# EAGLE schematic PowerManagementSchem (EAGLE 9.4.2)

## Sheet 1 of 5: DCDC Converters <And related filtering parts. Input connection but not outputs>
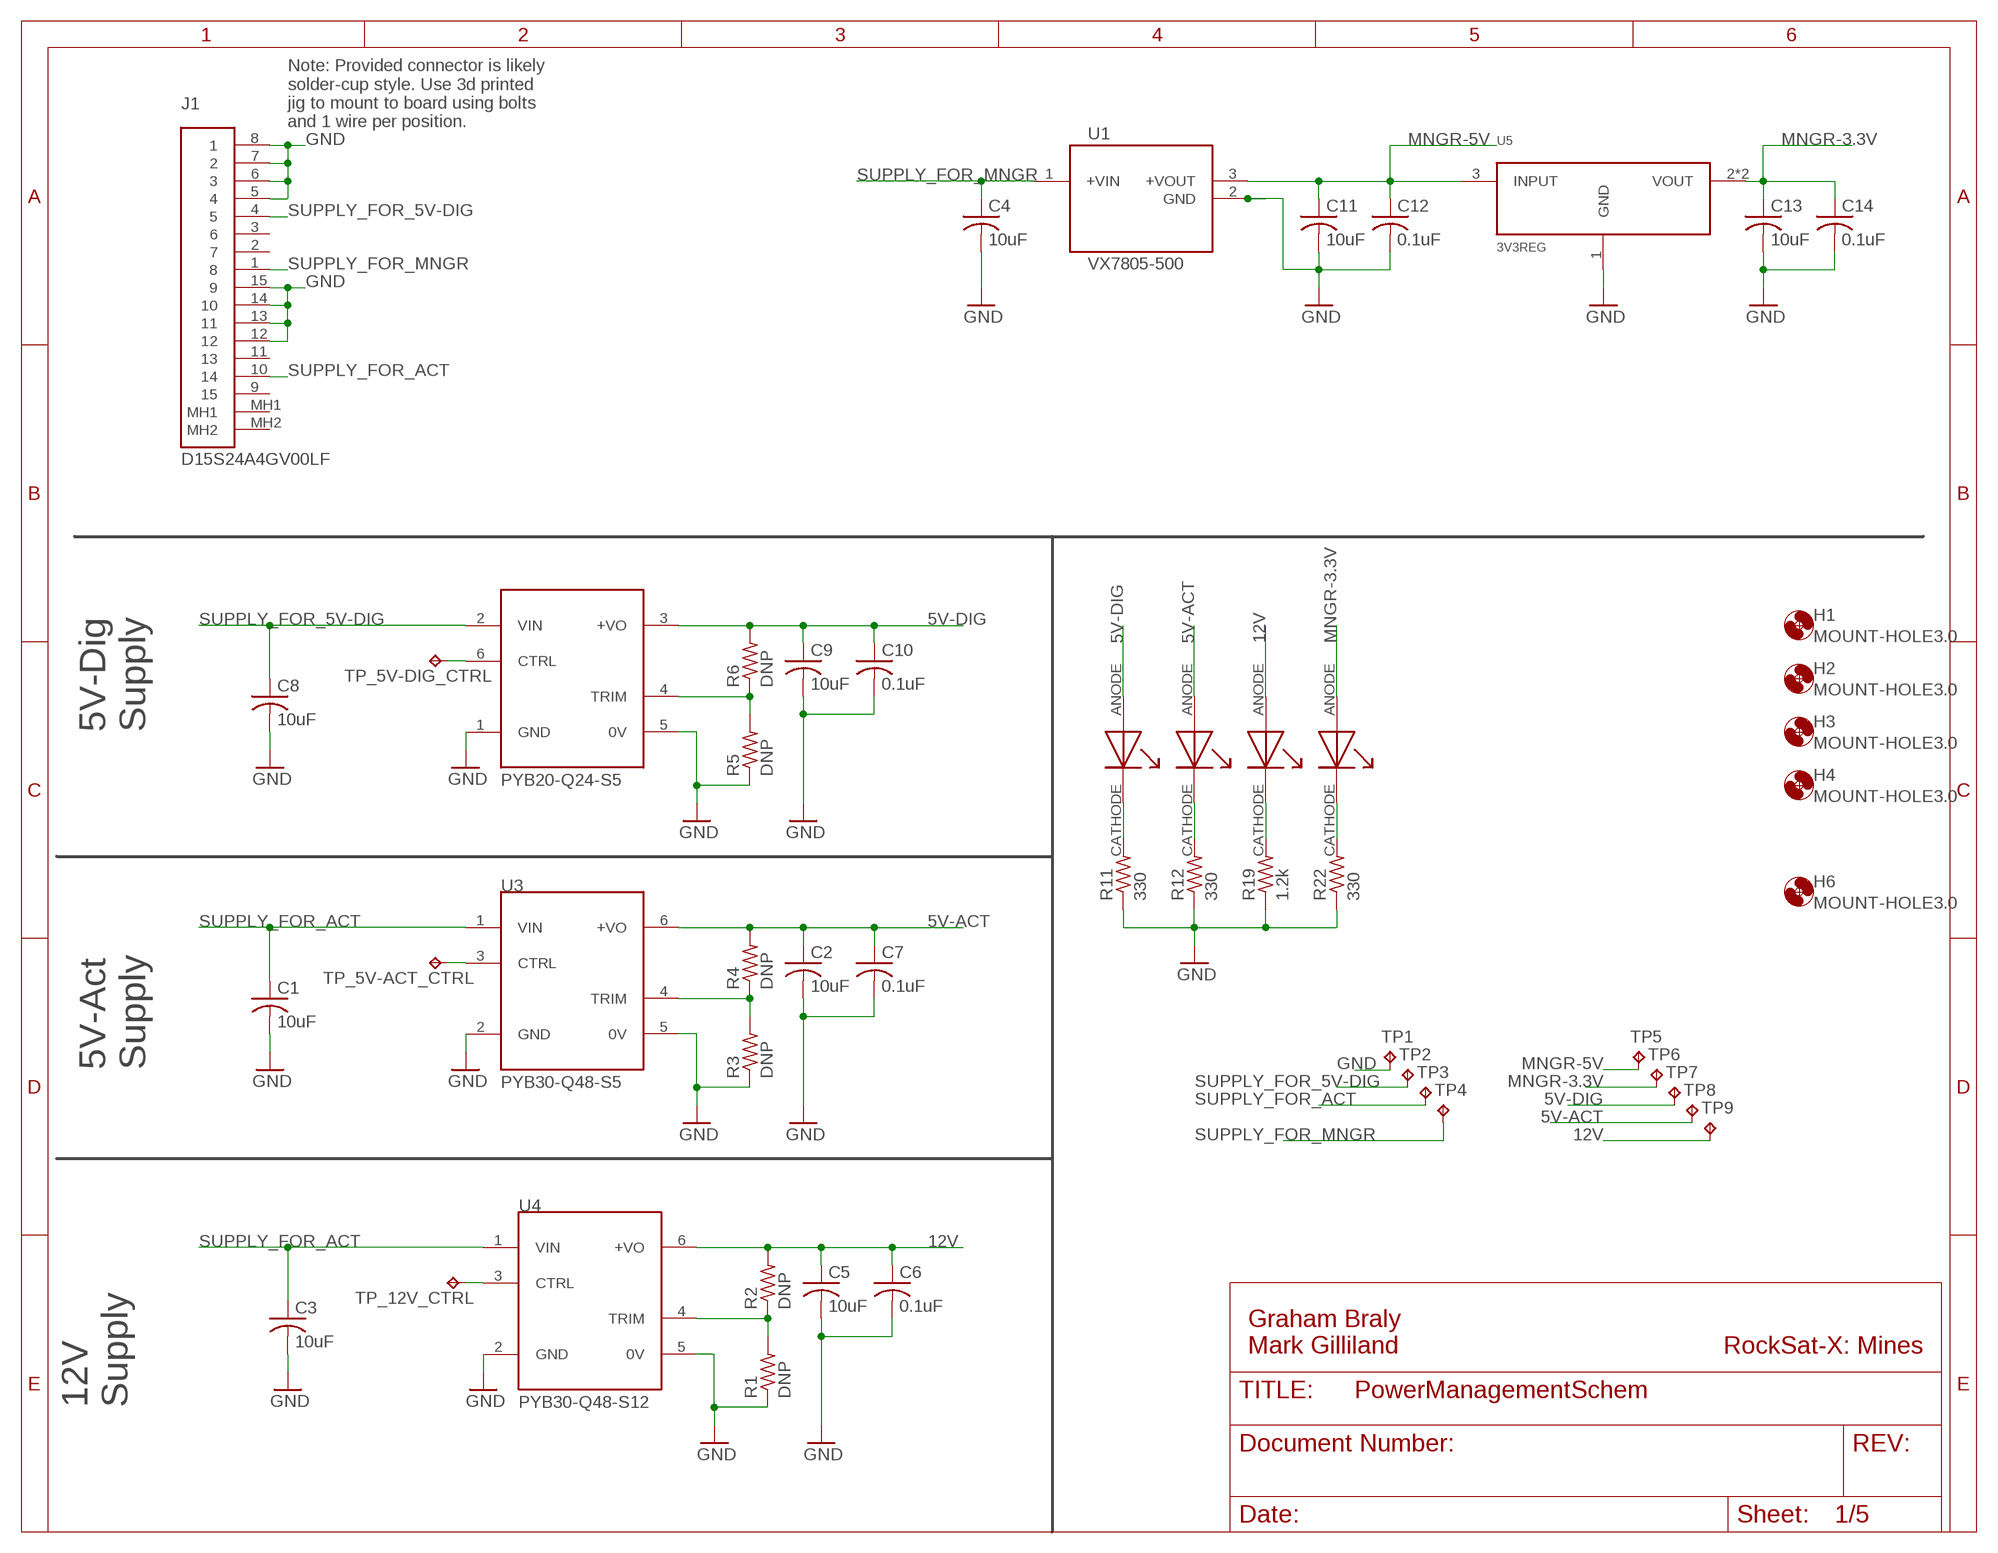
[diagram p0: schematic, sheet 1]

### Parts
C1  10uF  C-USC1206  [C1206]
C2  10uF  C-USC0805  [C0805]
C3  10uF  C-USC1206  [C1206]
C4  10uF  C-USC1206  [C1206]
C5  10uF  C-USC0805  [C0805]
C6  0.1uF  C-USC0805  [C0805]
C7  0.1uF  C-USC0805  [C0805]
C8  10uF  C-USC1206  [C1206]
C9  10uF  C-USC0805  [C0805]
C10  0.1uF  C-USC0805  [C0805]
C11  10uF  C-USC0805  [C0805]
C12  0.1uF  C-USC0805  [C0805]
C13  10uF  C-USC0805  [C0805]
C14  0.1uF  C-USC0805  [C0805]
H1  MOUNT-HOLE3.0  [3,0]
H2  MOUNT-HOLE3.0  [3,0]
H3  MOUNT-HOLE3.0  [3,0]
H4  MOUNT-HOLE3.0  [3,0]
H6  MOUNT-HOLE3.0  [3,0]
J1  D15S24A4GV00LF  [D15S24A4GV00LF]
R1  DNP  R-US_R0805  [R0805]
R2  DNP  R-US_R0805  [R0805]
R3  DNP  R-US_R0805  [R0805]
R4  DNP  R-US_R0805  [R0805]
R5  DNP  R-US_R0805  [R0805]
R6  DNP  R-US_R0805  [R0805]
R11  330  R-US_R0805  [R0805]
R12  330  R-US_R0805  [R0805]
R19  1.2k  R-US_R0805  [R0805]
R22  330  R-US_R0805  [R0805]
TP1  TPPAD1-13  [P1-13]
TP2  TPPAD1-13  [P1-13]
TP3  TPPAD1-13  [P1-13]
TP4  TPPAD1-13  [P1-13]
TP5  TPPAD1-13  [P1-13]
TP6  TPPAD1-13  [P1-13]
TP7  TPPAD1-13  [P1-13]
TP8  TPPAD1-13  [P1-13]
TP9  TPPAD1-13  [P1-13]
TP_5V-ACT_CTRL  TPPAD1-13  [P1-13]
TP_5V-DIG_CTRL  TPPAD1-13  [P1-13]
TP_12V_CTRL  TPPAD1-13  [P1-13]
U1  VX7805-500  [VX78012-500_VX7805-500]
U2  PYB20-Q24-S5  [CONV_PYB20-Q24-S5]
U3  PYB30-Q48-S5  [CONV_PYB30-Q48-S5]
U4  PYB30-Q48-S12  [CONV_PYB30-Q48-S12]
U5  3V3REG  [SOT223]
U$9  FLAT_LED  [FLAT_LED]
U$10  FLAT_LED  [FLAT_LED]
U$17  FLAT_LED  [FLAT_LED]
U$20  FLAT_LED  [FLAT_LED]

### Nets
5V-ACT: C2.1 C7.1 R4.2 TP8.TP U3.6(+VO) U$10.ANODE ; also sheet 3,4
5V-ACT-CTRL: TP_5V-ACT_CTRL.TP U3.3(CTRL)
5V-ACT-TRIM: R3.2 R4.1 U3.4(TRIM)
5V-DIG: C9.1 C10.1 R6.2 TP7.TP U2.3(+VO) U$9.ANODE ; also sheet 3,4
5V-DIG-CTRL: TP_5V-DIG_CTRL.TP U2.6(CTRL)
5V-DIG-TRIM: R5.2 R6.1 U2.4(TRIM)
12V: C5.1 C6.1 R2.2 TP9.TP U4.6(+VO) U$17.ANODE ; also sheet 5
12V-CTRL: TP_12V_CTRL.TP U4.3(CTRL)
12V-TRIM: R1.2 R2.1 U4.4(TRIM)
GND: C1.2 C2.2 C3.2 C4.2 C5.2 C6.2 C7.2 C8.2 C9.2 C10.2 C11.2 C12.2 C13.2 C14.2 J1.5 J1.6 J1.7 J1.8 J1.12 J1.13 J1.14 J1.15 R1.1 R11.1 R12.1 R19.1 R22.1 TP1.TP U1.2(GND) U2.1(GND) U3.2(GND) U4.2(GND) U4.5(0V) U5.1(GND) ; also sheet 2,3,4,5
MNGR-3.3V: C13.1 C14.1 TP6.TP U5.2(VOUT) U5.4(VOUT) U$20.ANODE ; also sheet 2,3,4
MNGR-5V: C11.1 C12.1 TP5.TP U1.3(+VOUT) U5.3(INPUT) ; also sheet 2
N$5: R3.1 U3.5(0V) ; supply symbol labelled GND
N$8: R5.1 U2.5(0V) ; supply symbol labelled GND
N$17: R11.2 U$9.CATHODE
N$18: R12.2 U$10.CATHODE
N$19: R19.2 U$17.CATHODE
N$20: R22.2 U$20.CATHODE
SUPPLY_FOR_5V-DIG [hv-lines]: C8.1 J1.4 TP2.TP U2.2(VIN)
SUPPLY_FOR_ACT [hv-lines]: C1.1 C3.1 J1.10 TP3.TP U3.1(VIN) U4.1(VIN)
SUPPLY_FOR_MNGR: C4.1 J1.1 TP4.TP U1.1(+VIN)
Unconnected: J1.2 J1.3 J1.9 J1.11 J1.MH1 J1.MH2

### Notes on the sheet
- Note: Provided connector is likely 
  solder-cup style. Use 3d printed
  jig to mount to board using bolts
  and 1 wire per position.
- 5V-Dig
  Supply
- 5V-Act
  Supply
- Graham Braly
  Mark Gilliland
- RockSat-X: Mines
- 12V 
  Supply

## Sheet 2 of 5: Teensy Connections <Connections for the Teensy and possible datalogging capability. Do not include op-amps here.>
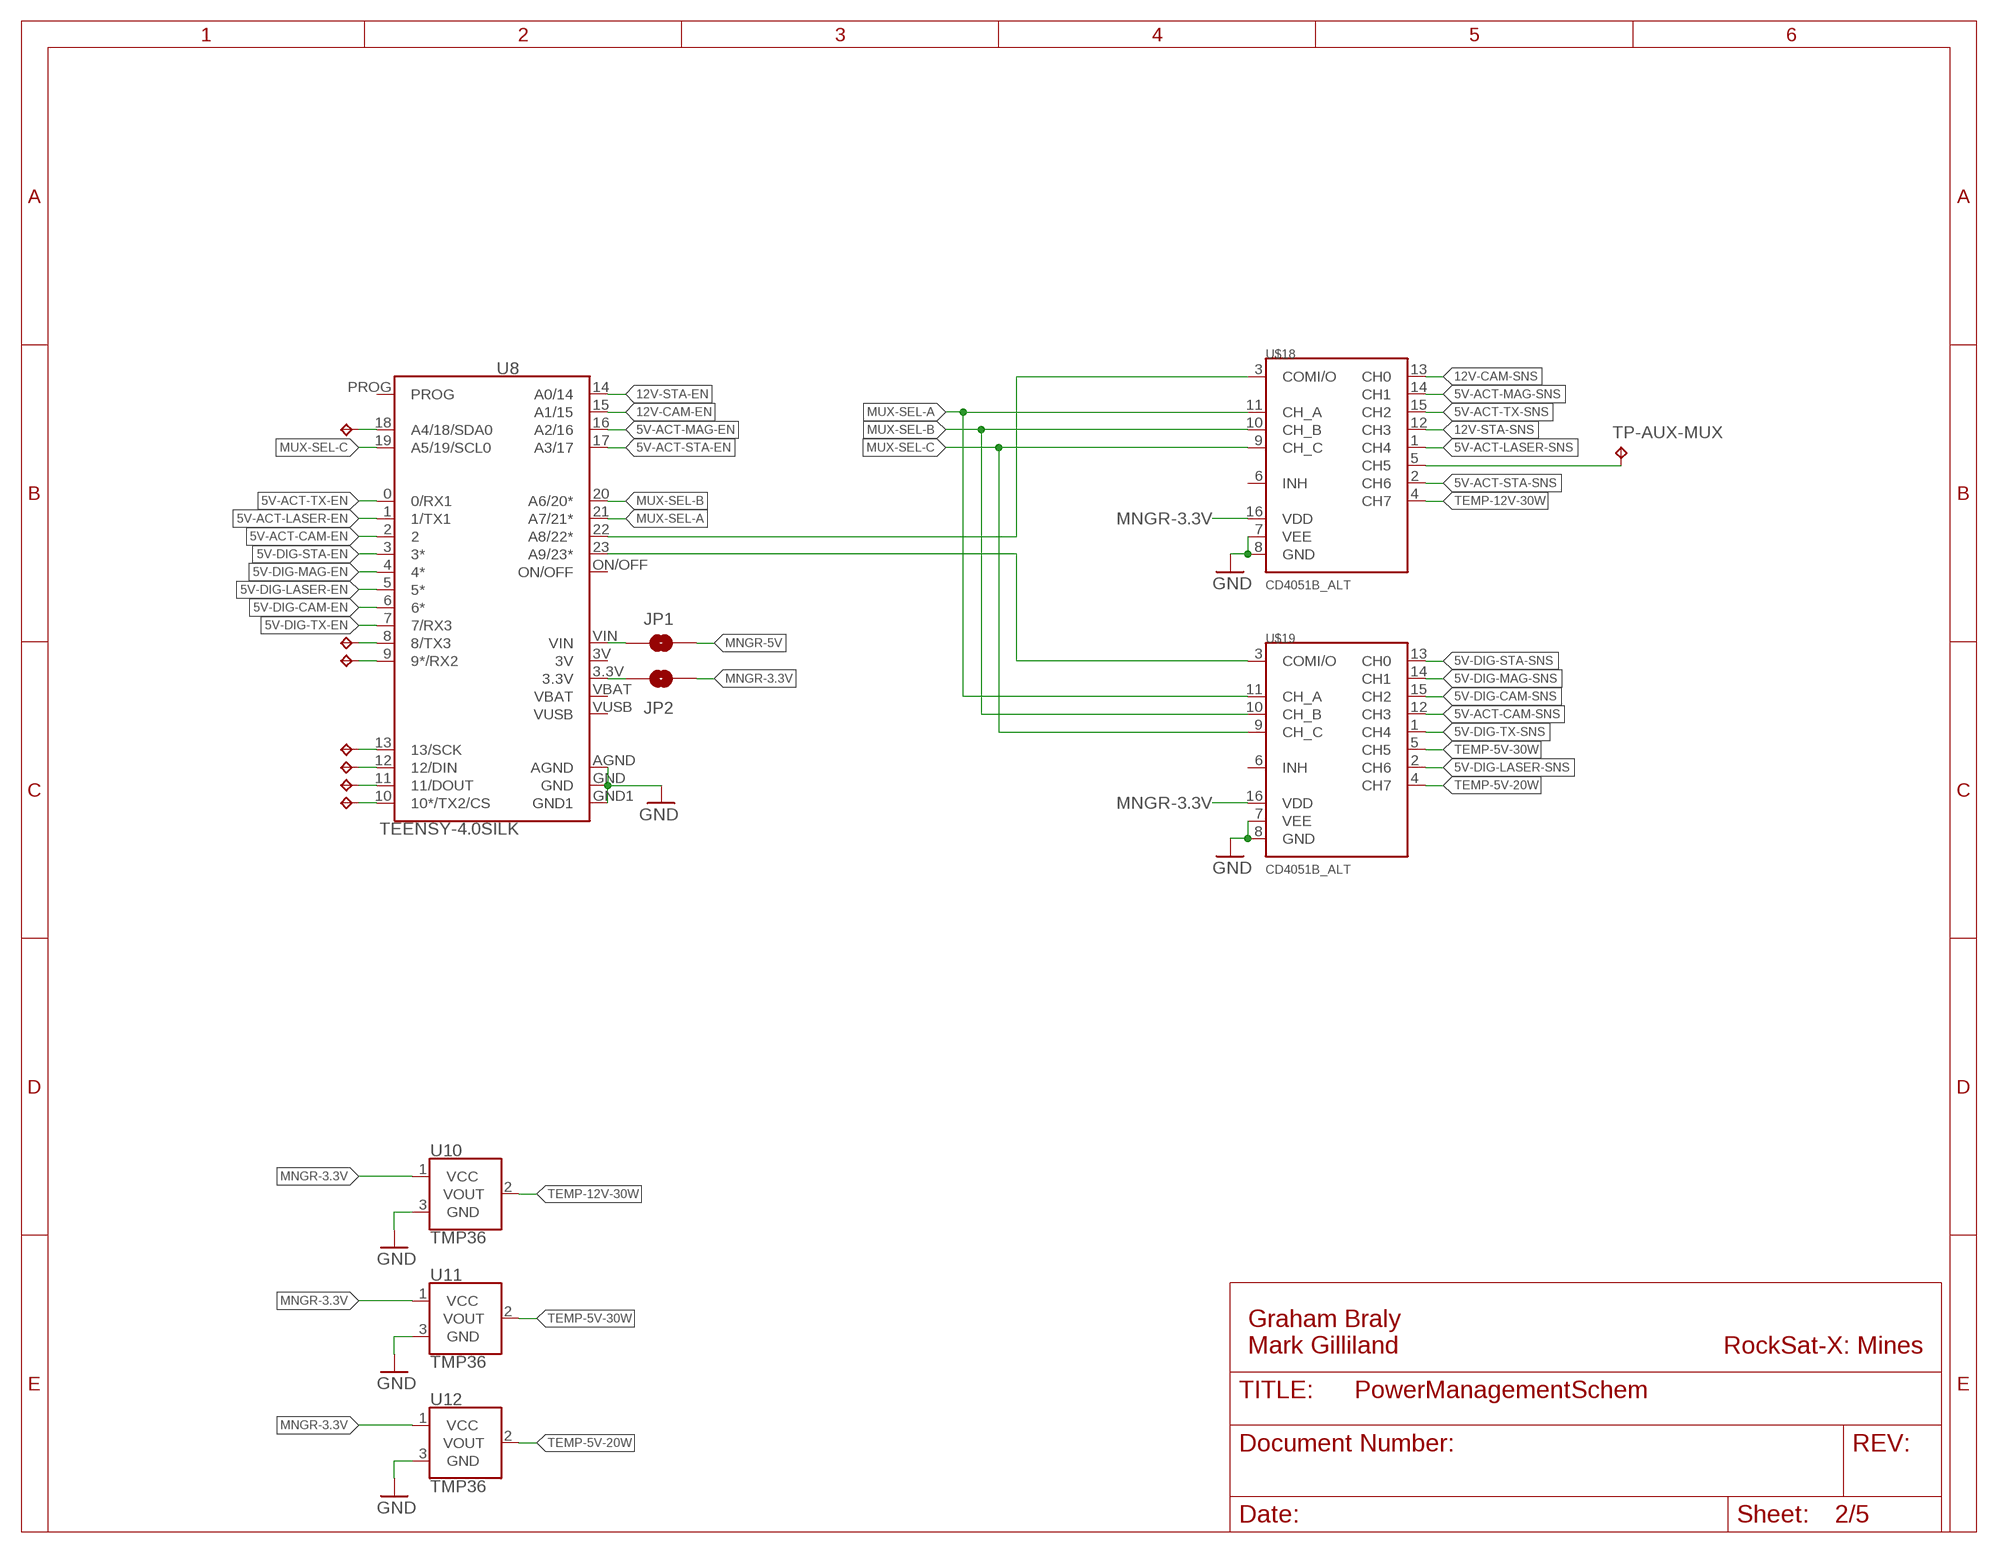
[diagram p1: schematic, sheet 2]

### Parts
JP1  JUMPER-SMT_2_NO_NO-SILK  [SMT-JUMPER_2_NO_NO-SILK]
JP2  JUMPER-SMT_2_NO_NO-SILK  [SMT-JUMPER_2_NO_NO-SILK]
TP10  TPPAD1-13  [P1-13]
TP11  TPPAD1-13  [P1-13]
TP12  TPPAD1-13  [P1-13]
TP13  TPPAD1-13  [P1-13]
TP14  TPPAD1-13  [P1-13]
TP15  TPPAD1-13  [P1-13]
TP16  TPPAD1-13  [P1-13]
TP-AUX-MUX  TPPAD1-13  [P1-13]
U8  TEENSY-4.0SILK  [TEENSY-4.0]
U10  TMP36  TMP36GT9  [TO-92]
U11  TMP36  TMP36GT9  [TO-92]
U12  TMP36  TMP36GT9  [TO-92]
U$18  CD4051B_ALT  [SOIC16N]
U$19  CD4051B_ALT  [SOIC16N]

### Nets
5V-ACT-CAM-EN: U8.2 ; also sheet 4
5V-ACT-CAM-SNS: U$19.12(CH3) ; also sheet 4
5V-ACT-LASER-EN: U8.1(1/TX1) ; also sheet 3
5V-ACT-LASER-SNS: U$18.1(CH4) ; also sheet 3
5V-ACT-MAG-EN: U8.16(A2/16) ; also sheet 4
5V-ACT-MAG-SNS: U$18.14(CH1) ; also sheet 4
5V-ACT-STA-EN: U8.17(A3/17) ; also sheet 4
5V-ACT-STA-SNS: U$18.2(CH6) ; also sheet 4
5V-ACT-TX-EN: U8.0(0/RX1) ; also sheet 3
5V-ACT-TX-SNS: U$18.15(CH2) ; also sheet 3
5V-DIG-CAM-EN: U8.6(6*) ; also sheet 4
5V-DIG-CAM-SNS: U$19.15(CH2) ; also sheet 4
5V-DIG-LASER-EN: U8.5(5*) ; also sheet 3
5V-DIG-LASER-SNS: U$19.2(CH6) ; also sheet 3
5V-DIG-MAG-EN: U8.4(4*) ; also sheet 4
5V-DIG-MAG-SNS: U$19.14(CH1) ; also sheet 4
5V-DIG-STA-EN: U8.3(3*) ; also sheet 4
5V-DIG-STA-SNS: U$19.13(CH0) ; also sheet 4
5V-DIG-TX-EN: U8.7(7/RX3) ; also sheet 3
5V-DIG-TX-SNS: U$19.1(CH4) ; also sheet 3
12V-CAM-EN: U8.15(A1/15) ; also sheet 5
12V-CAM-SNS: U$18.13(CH0) ; also sheet 5
12V-STA-EN: U8.14(A0/14) ; also sheet 5
12V-STA-SNS: U$18.12(CH3) ; also sheet 5
CURRENT-SNS-A: U8.22(A8/22*) U$18.3(COMI/O)
CURRENT-SNS-B: U8.23(A9/23*) U$19.3(COMI/O)
GND: U8.AGND U8.GND U8.GND1 U10.3(GND) U11.3(GND) U12.3(GND) U$18.7(VEE) U$18.8(GND) U$19.7(VEE) U$19.8(GND) ; also sheet 1,3,4,5
MNGR-3.3V: JP2.2 U10.1(VCC) U11.1(VCC) U12.1(VCC) U$18.16(VDD) U$19.16(VDD) ; also sheet 1,3,4
MNGR-5V: JP1.2 ; also sheet 1
MUX-SEL-A: U8.21(A7/21*) U$18.11(CH_A) U$19.11(CH_A)
MUX-SEL-B: U8.20(A6/20*) U$18.10(CH_B) U$19.10(CH_B)
MUX-SEL-C: U8.19(A5/19/SCL0) U$18.9(CH_C) U$19.9(CH_C)
N$1: TP-AUX-MUX.TP U$18.5(CH5)
N$2: TP10.TP U8.8(8/TX3)
N$3: TP11.TP U8.9(9*/RX2)
N$4: TP12.TP U8.13(13/SCK)
N$6: TP13.TP U8.12(12/DIN)
N$7: TP14.TP U8.11(11/DOUT)
N$33: TP15.TP U8.10(10*/TX2/CS)
N$35: TP16.TP U8.18(A4/18/SDA0)
N$37: JP1.1 U8.VIN
N$38: JP2.1 U8.3.3V
TEMP-5V-20W: U12.2(VOUT) U$19.4(CH7)
TEMP-5V-30W: U11.2(VOUT) U$19.5(CH5)
TEMP-12V-30W: U10.2(VOUT) U$18.4(CH7)
Unconnected: U8.ON/OFF U8.PROG U$18.6(INH) U$19.6(INH)

### Notes on the sheet
- Graham Braly
  Mark Gilliland
- RockSat-X: Mines

## Sheet 3 of 5: TX & Laser Control and Sense <Current Sense circuits, outputs, and multiplexing>
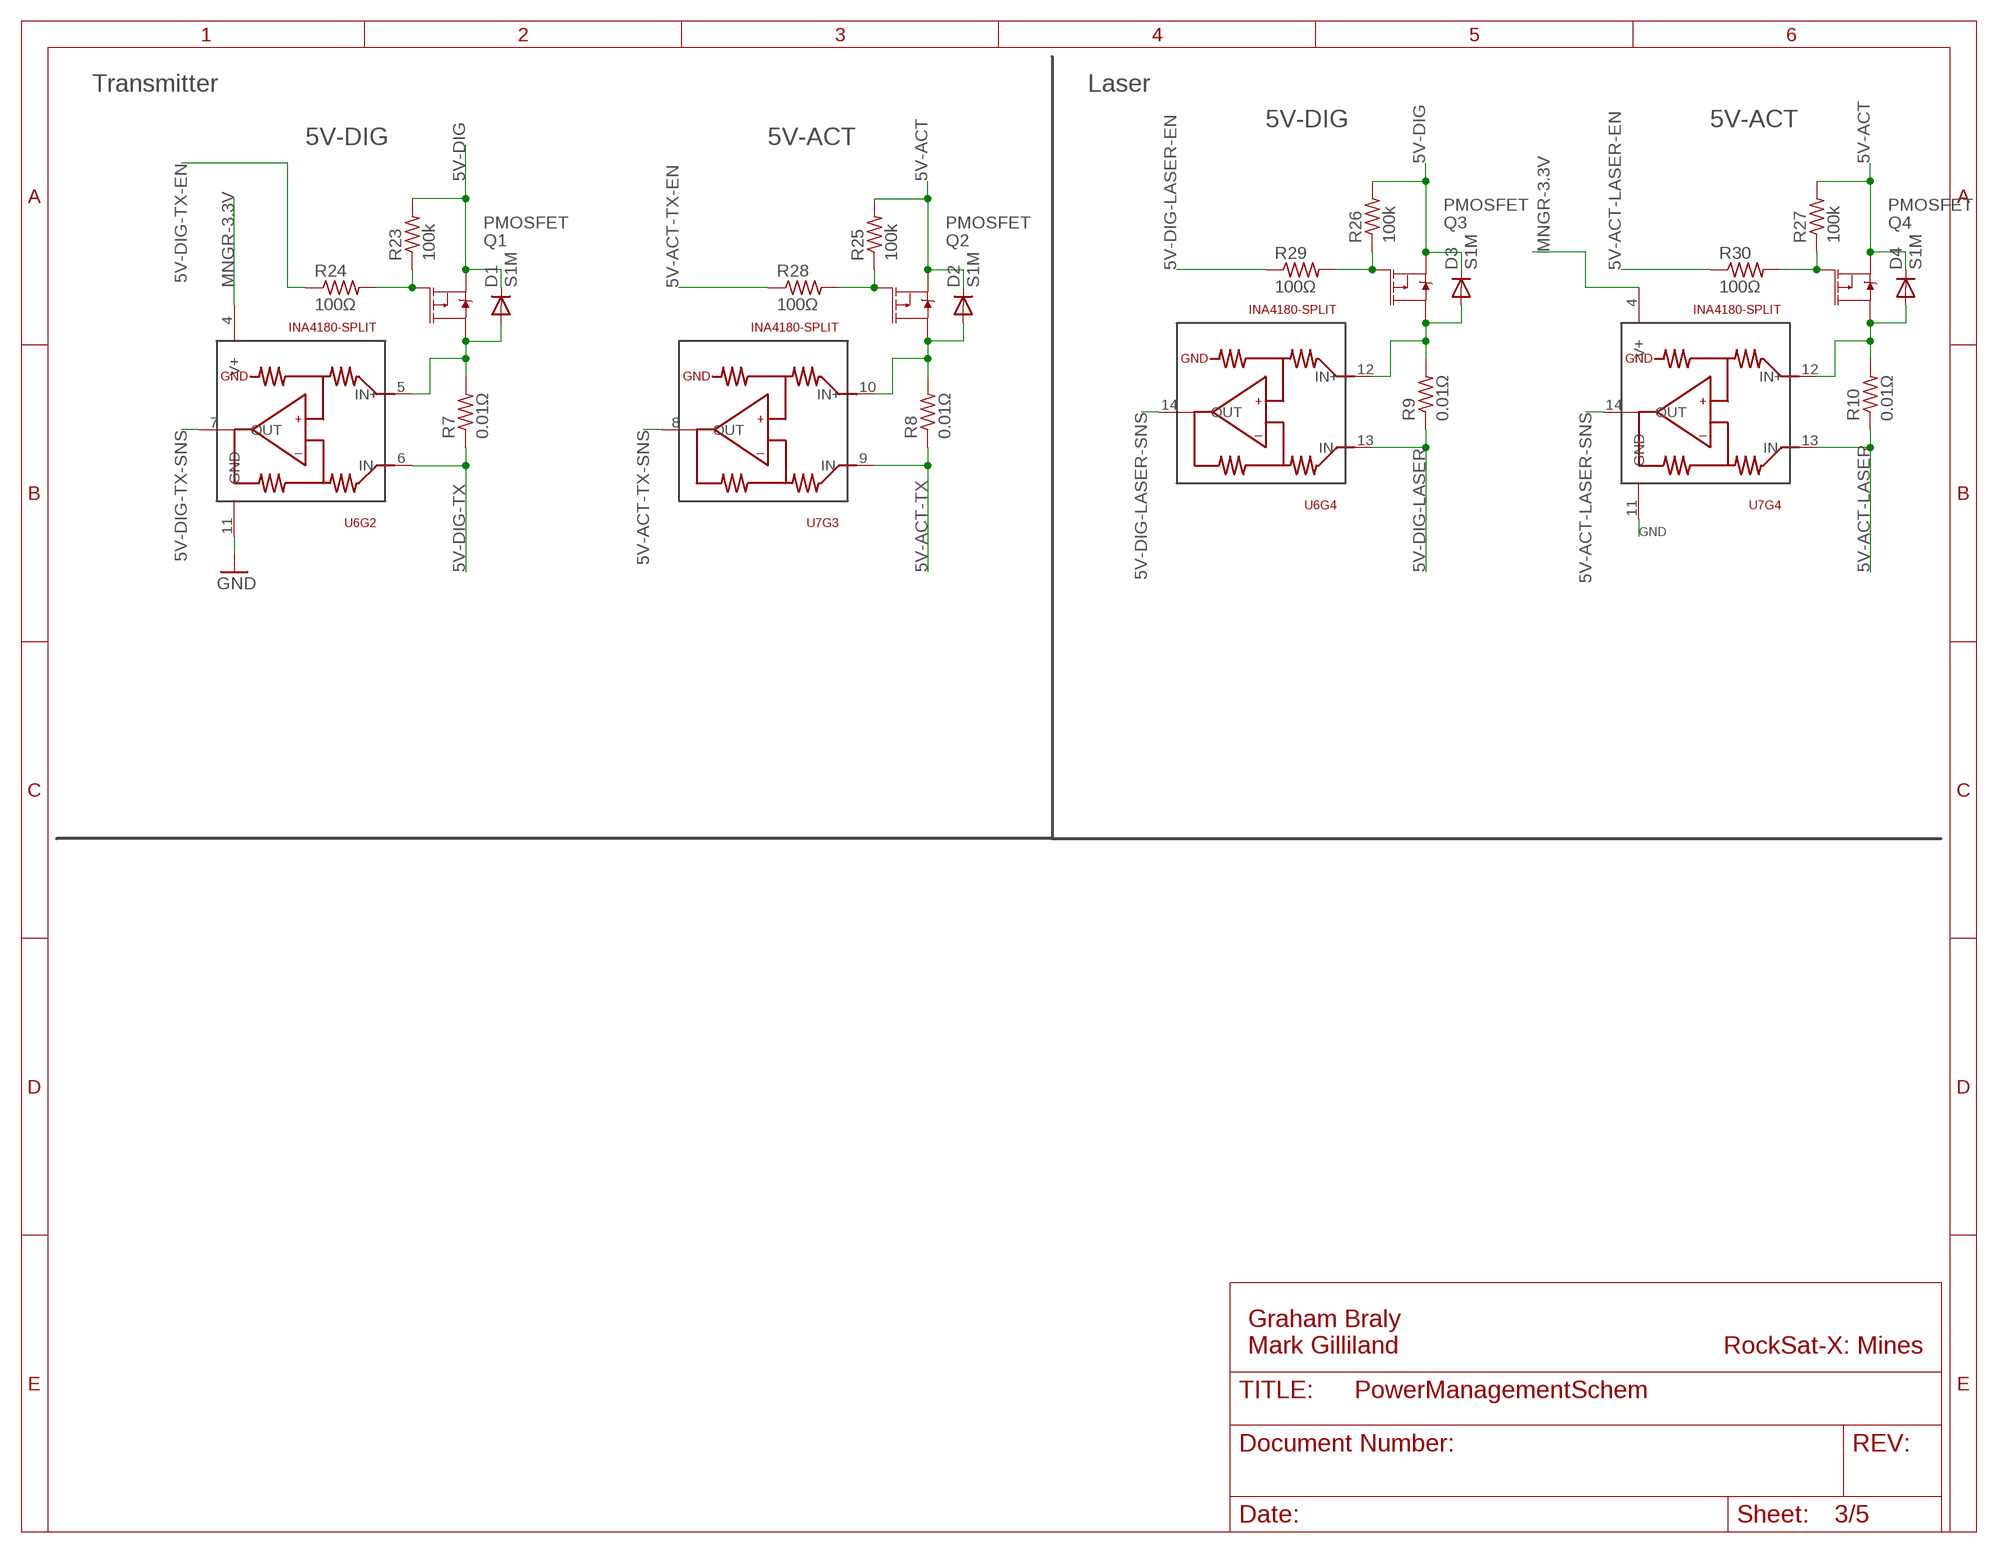
[diagram p2: schematic, sheet 3]

### Parts
D1  S1M  [SMA]
D2  S1M  [SMA]
D3  S1M  [SMA]
D4  S1M  [SMA]
Q1  PMOSFET  [DPAK]
Q2  PMOSFET  [DPAK]
Q3  PMOSFET  [DPAK]
Q4  PMOSFET  [DPAK]
R7  0.01Ω  R-US_R1206  [R1206]
R8  0.01Ω  R-US_R1206  [R1206]
R9  0.01Ω  R-US_R1206  [R1206]
R10  0.01Ω  R-US_R1206  [R1206]
R23  100k  R-US_R0805  [R0805]
R24  100Ω  R-US_R0805  [R0805]
R25  100k  R-US_R0805  [R0805]
R26  100k  R-US_R0805  [R0805]
R27  100k  R-US_R0805  [R0805]
R28  100Ω  R-US_R0805  [R0805]
R29  100Ω  R-US_R0805  [R0805]
R30  100Ω  R-US_R0805  [R0805]
U6  INA4180-SPLIT  [TSSOP14]
U7  INA4180-SPLIT  [TSSOP14]

### Nets
5V-ACT: D2.C D4.C Q2.3(S) Q4.3(S) R25.2 R27.2 ; also sheet 1,4
5V-ACT-LASER: R10.1 U7.13(IN-) ; also sheet 5
5V-ACT-LASER-EN: R30.1 ; also sheet 2
5V-ACT-LASER-SNS: U7.14(OUT) ; also sheet 2
5V-ACT-TX: R8.1 U7.9(IN-) ; also sheet 5
5V-ACT-TX-EN: R28.1 ; also sheet 2
5V-ACT-TX-SNS: U7.8(OUT) ; also sheet 2
5V-DIG: D1.C D3.C Q1.3(S) Q3.3(S) R23.2 R26.2 ; also sheet 1,4
5V-DIG-LASER: R9.1 U6.13(IN-) ; also sheet 5
5V-DIG-LASER-EN: R29.1 ; also sheet 2
5V-DIG-LASER-SNS: U6.14(OUT) ; also sheet 2
5V-DIG-TX: R7.1 U6.6(IN-) ; also sheet 5
5V-DIG-TX-EN: R24.1 ; also sheet 2
5V-DIG-TX-SNS: U6.7(OUT) ; also sheet 2
GND: U6.11(GND) U7.11(GND) ; also sheet 1,2,4,5
MNGR-3.3V: U6.4(V+) U7.4(V+) ; also sheet 1,2,4
N$9: Q1.1(G) R23.1 R24.2
N$10: Q2.1(G) R25.1 R28.2
N$11: D1.A Q1.4(D) R7.2 U6.5(IN+)
N$12: D2.A Q2.4(D) R8.2 U7.10(IN+)
N$13: Q3.1(G) R26.1 R29.2
N$14: D3.A Q3.4(D) R9.2 U6.12(IN+)
N$15: Q4.1(G) R27.1 R30.2
N$16: D4.A Q4.4(D) R10.2 U7.12(IN+)

### Notes on the sheet
- Transmitter | Laser
- 5V-DIG | 5V-ACT
- 5V-DIG | 5V-ACT
- Graham Braly
  Mark Gilliland
- RockSat-X: Mines

## Sheet 4 of 5: Camera & Static Control and Sense <Current Sense circuits, outputs, and multiplexing>
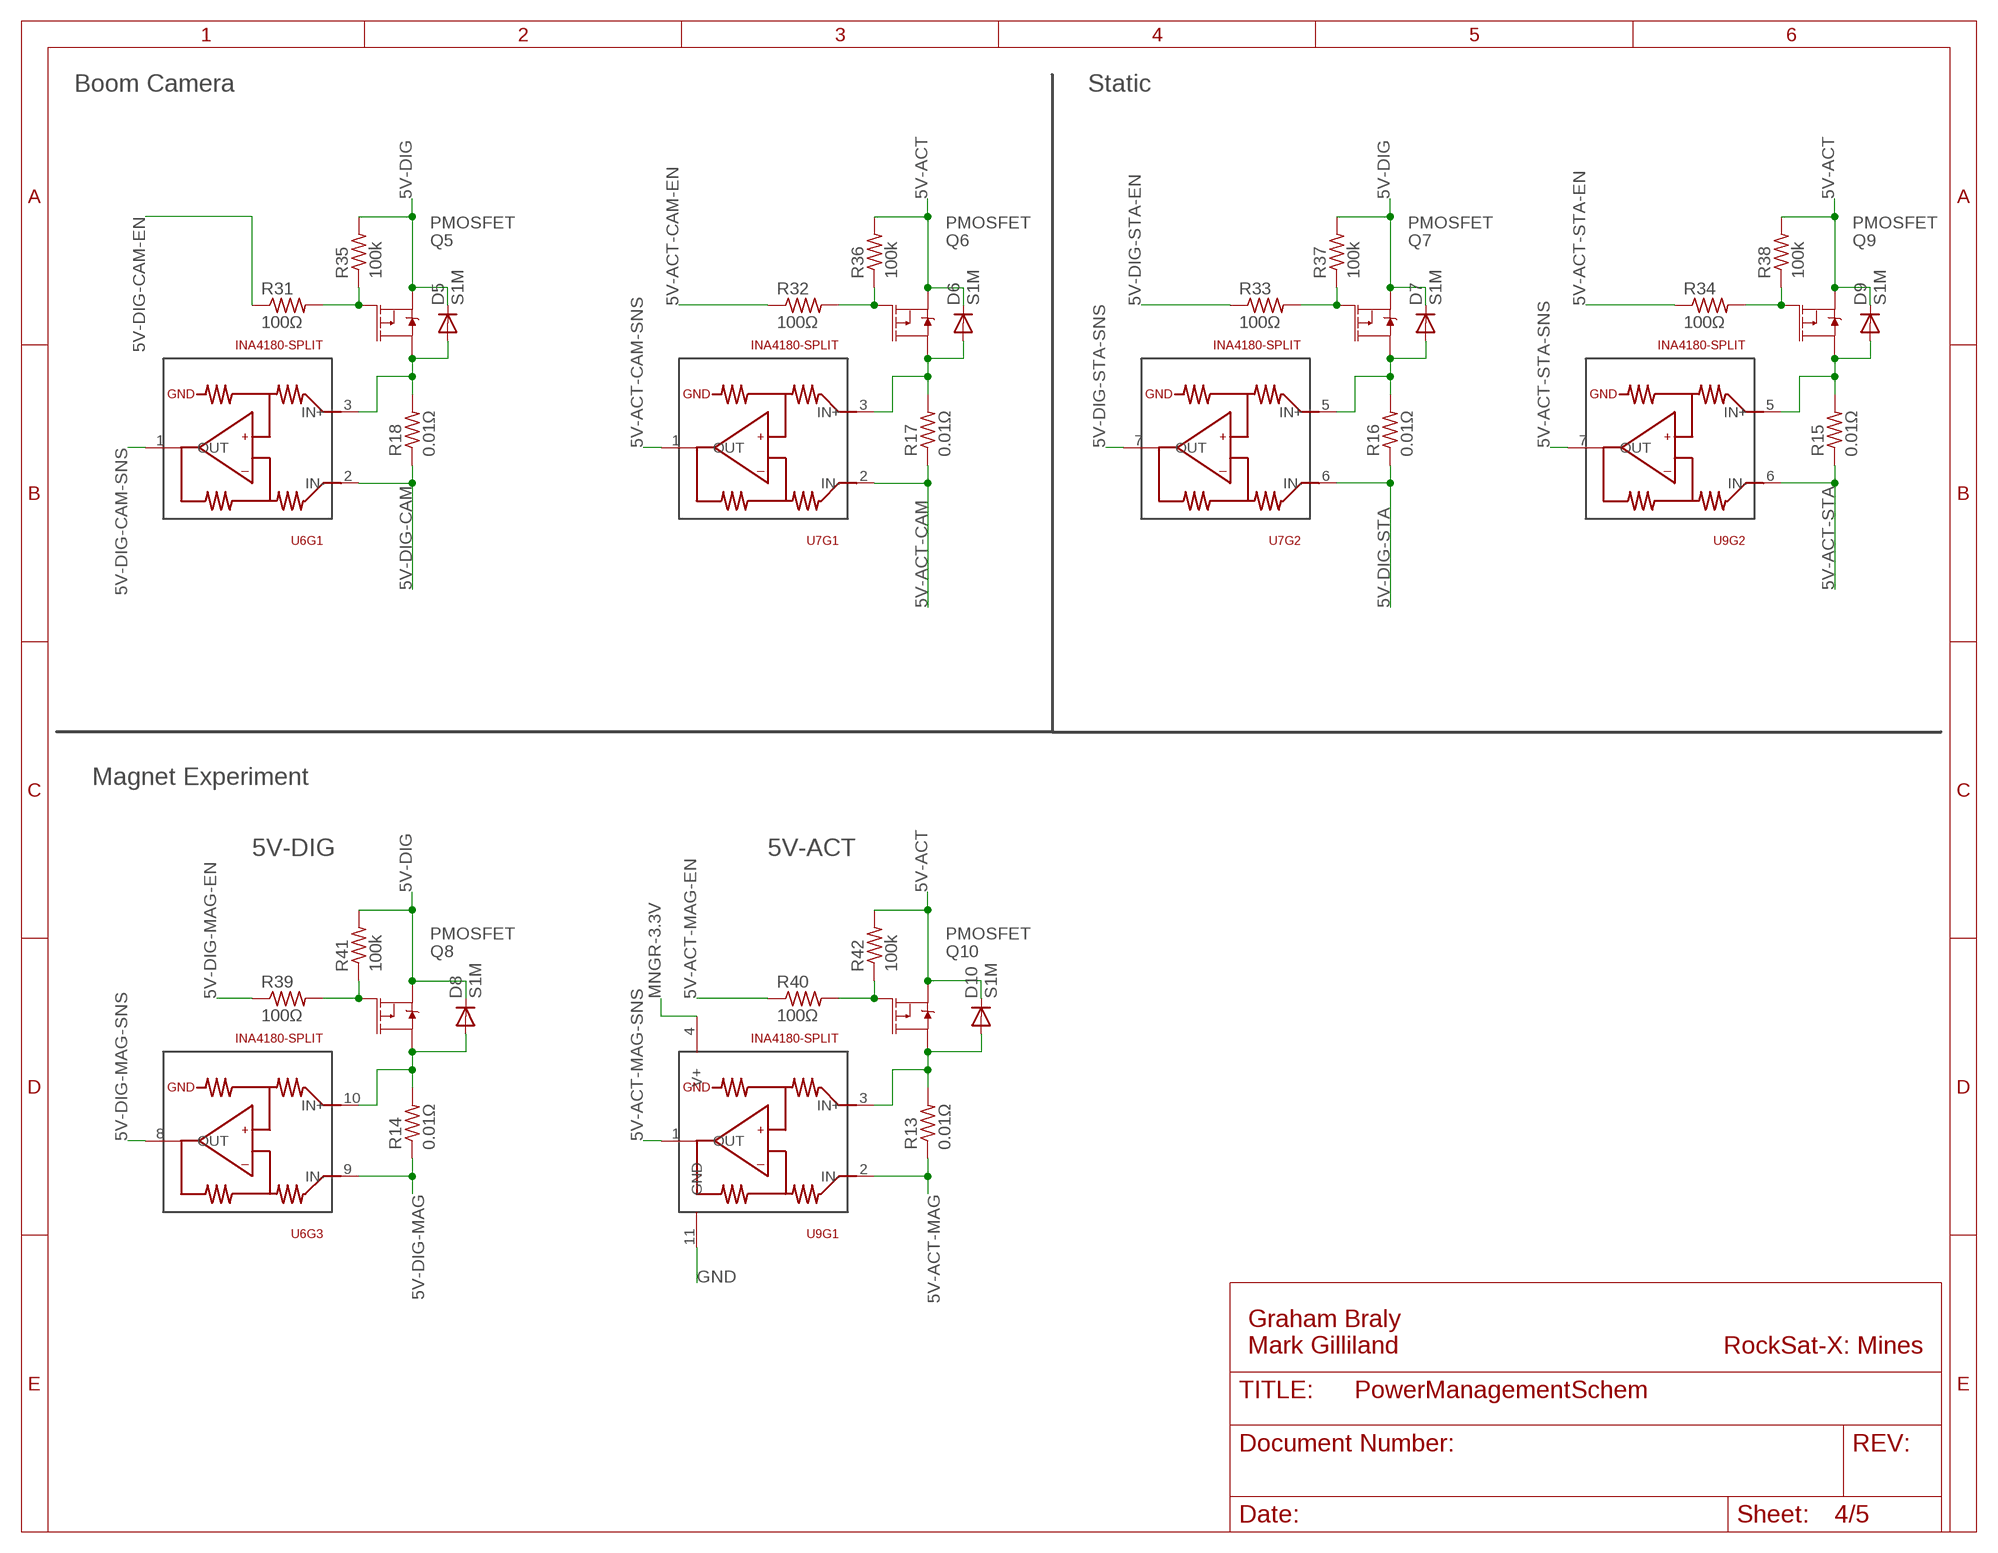
[diagram p3: schematic, sheet 4]

### Parts
D5  S1M  [SMA]
D6  S1M  [SMA]
D7  S1M  [SMA]
D8  S1M  [SMA]
D9  S1M  [SMA]
D10  S1M  [SMA]
Q5  PMOSFET  [DPAK]
Q6  PMOSFET  [DPAK]
Q7  PMOSFET  [DPAK]
Q8  PMOSFET  [DPAK]
Q9  PMOSFET  [DPAK]
Q10  PMOSFET  [DPAK]
R13  0.01Ω  R-US_R1206  [R1206]
R14  0.01Ω  R-US_R1206  [R1206]
R15  0.01Ω  R-US_R1206  [R1206]
R16  0.01Ω  R-US_R1206  [R1206]
R17  0.01Ω  R-US_R1206  [R1206]
R18  0.01Ω  R-US_R1206  [R1206]
R31  100Ω  R-US_R0805  [R0805]
R32  100Ω  R-US_R0805  [R0805]
R33  100Ω  R-US_R0805  [R0805]
R34  100Ω  R-US_R0805  [R0805]
R35  100k  R-US_R0805  [R0805]
R36  100k  R-US_R0805  [R0805]
R37  100k  R-US_R0805  [R0805]
R38  100k  R-US_R0805  [R0805]
R39  100Ω  R-US_R0805  [R0805]
R40  100Ω  R-US_R0805  [R0805]
R41  100k  R-US_R0805  [R0805]
R42  100k  R-US_R0805  [R0805]
U9  INA4180-SPLIT  [TSSOP14]

### Nets
5V-ACT: D6.C D9.C D10.C Q6.3(S) Q9.3(S) Q10.3(S) R36.2 R38.2 R42.2 ; also sheet 1,3
5V-ACT-CAM: R17.1 U7.2(IN-) ; also sheet 5
5V-ACT-CAM-EN: R32.1 ; also sheet 2
5V-ACT-CAM-SNS: U7.1(OUT) ; also sheet 2
5V-ACT-MAG: R13.1 U9.2(IN-) ; also sheet 5
5V-ACT-MAG-EN: R40.1 ; also sheet 2
5V-ACT-MAG-SNS: U9.1(OUT) ; also sheet 2
5V-ACT-STA: R15.1 U9.6(IN-) ; also sheet 5
5V-ACT-STA-EN: R34.1 ; also sheet 2
5V-ACT-STA-SNS: U9.7(OUT) ; also sheet 2
5V-DIG: D5.C D7.C D8.C Q5.3(S) Q7.3(S) Q8.3(S) R35.2 R37.2 R41.2 ; also sheet 1,3
5V-DIG-CAM: R18.1 U6.2(IN-) ; also sheet 5
5V-DIG-CAM-EN: R31.1 ; also sheet 2
5V-DIG-CAM-SNS: U6.1(OUT) ; also sheet 2
5V-DIG-MAG: R14.1 U6.9(IN-) ; also sheet 5
5V-DIG-MAG-EN: R39.1 ; also sheet 2
5V-DIG-MAG-SNS: U6.8(OUT) ; also sheet 2
5V-DIG-STA: R16.1 U7.6(IN-) ; also sheet 5
5V-DIG-STA-EN: R33.1 ; also sheet 2
5V-DIG-STA-SNS: U7.7(OUT) ; also sheet 2
GND: U9.11(GND) ; also sheet 1,2,3,5
MNGR-3.3V: U9.4(V+) ; also sheet 1,2,3
N$21: Q10.1(G) R40.2 R42.1
N$22: D10.A Q10.4(D) R13.2 U9.3(IN+)
N$23: Q8.1(G) R39.2 R41.1
N$24: D8.A Q8.4(D) R14.2 U6.10(IN+)
N$25: Q9.1(G) R34.2 R38.1
N$26: D9.A Q9.4(D) R15.2 U9.5(IN+)
N$27: Q7.1(G) R33.2 R37.1
N$28: D7.A Q7.4(D) R16.2 U7.5(IN+)
N$29: Q6.1(G) R32.2 R36.1
N$30: D6.A Q6.4(D) R17.2 U7.3(IN+)
N$31: Q5.1(G) R31.2 R35.1
N$32: D5.A Q5.4(D) R18.2 U6.3(IN+)

### Notes on the sheet
- Boom Camera | Static
- Magnet Experiment
- 5V-DIG | 5V-ACT
- Graham Braly
  Mark Gilliland
- RockSat-X: Mines

## Sheet 5 of 5: 12V Control and Sense <Current Sense circuits, outputs, and multiplexing>
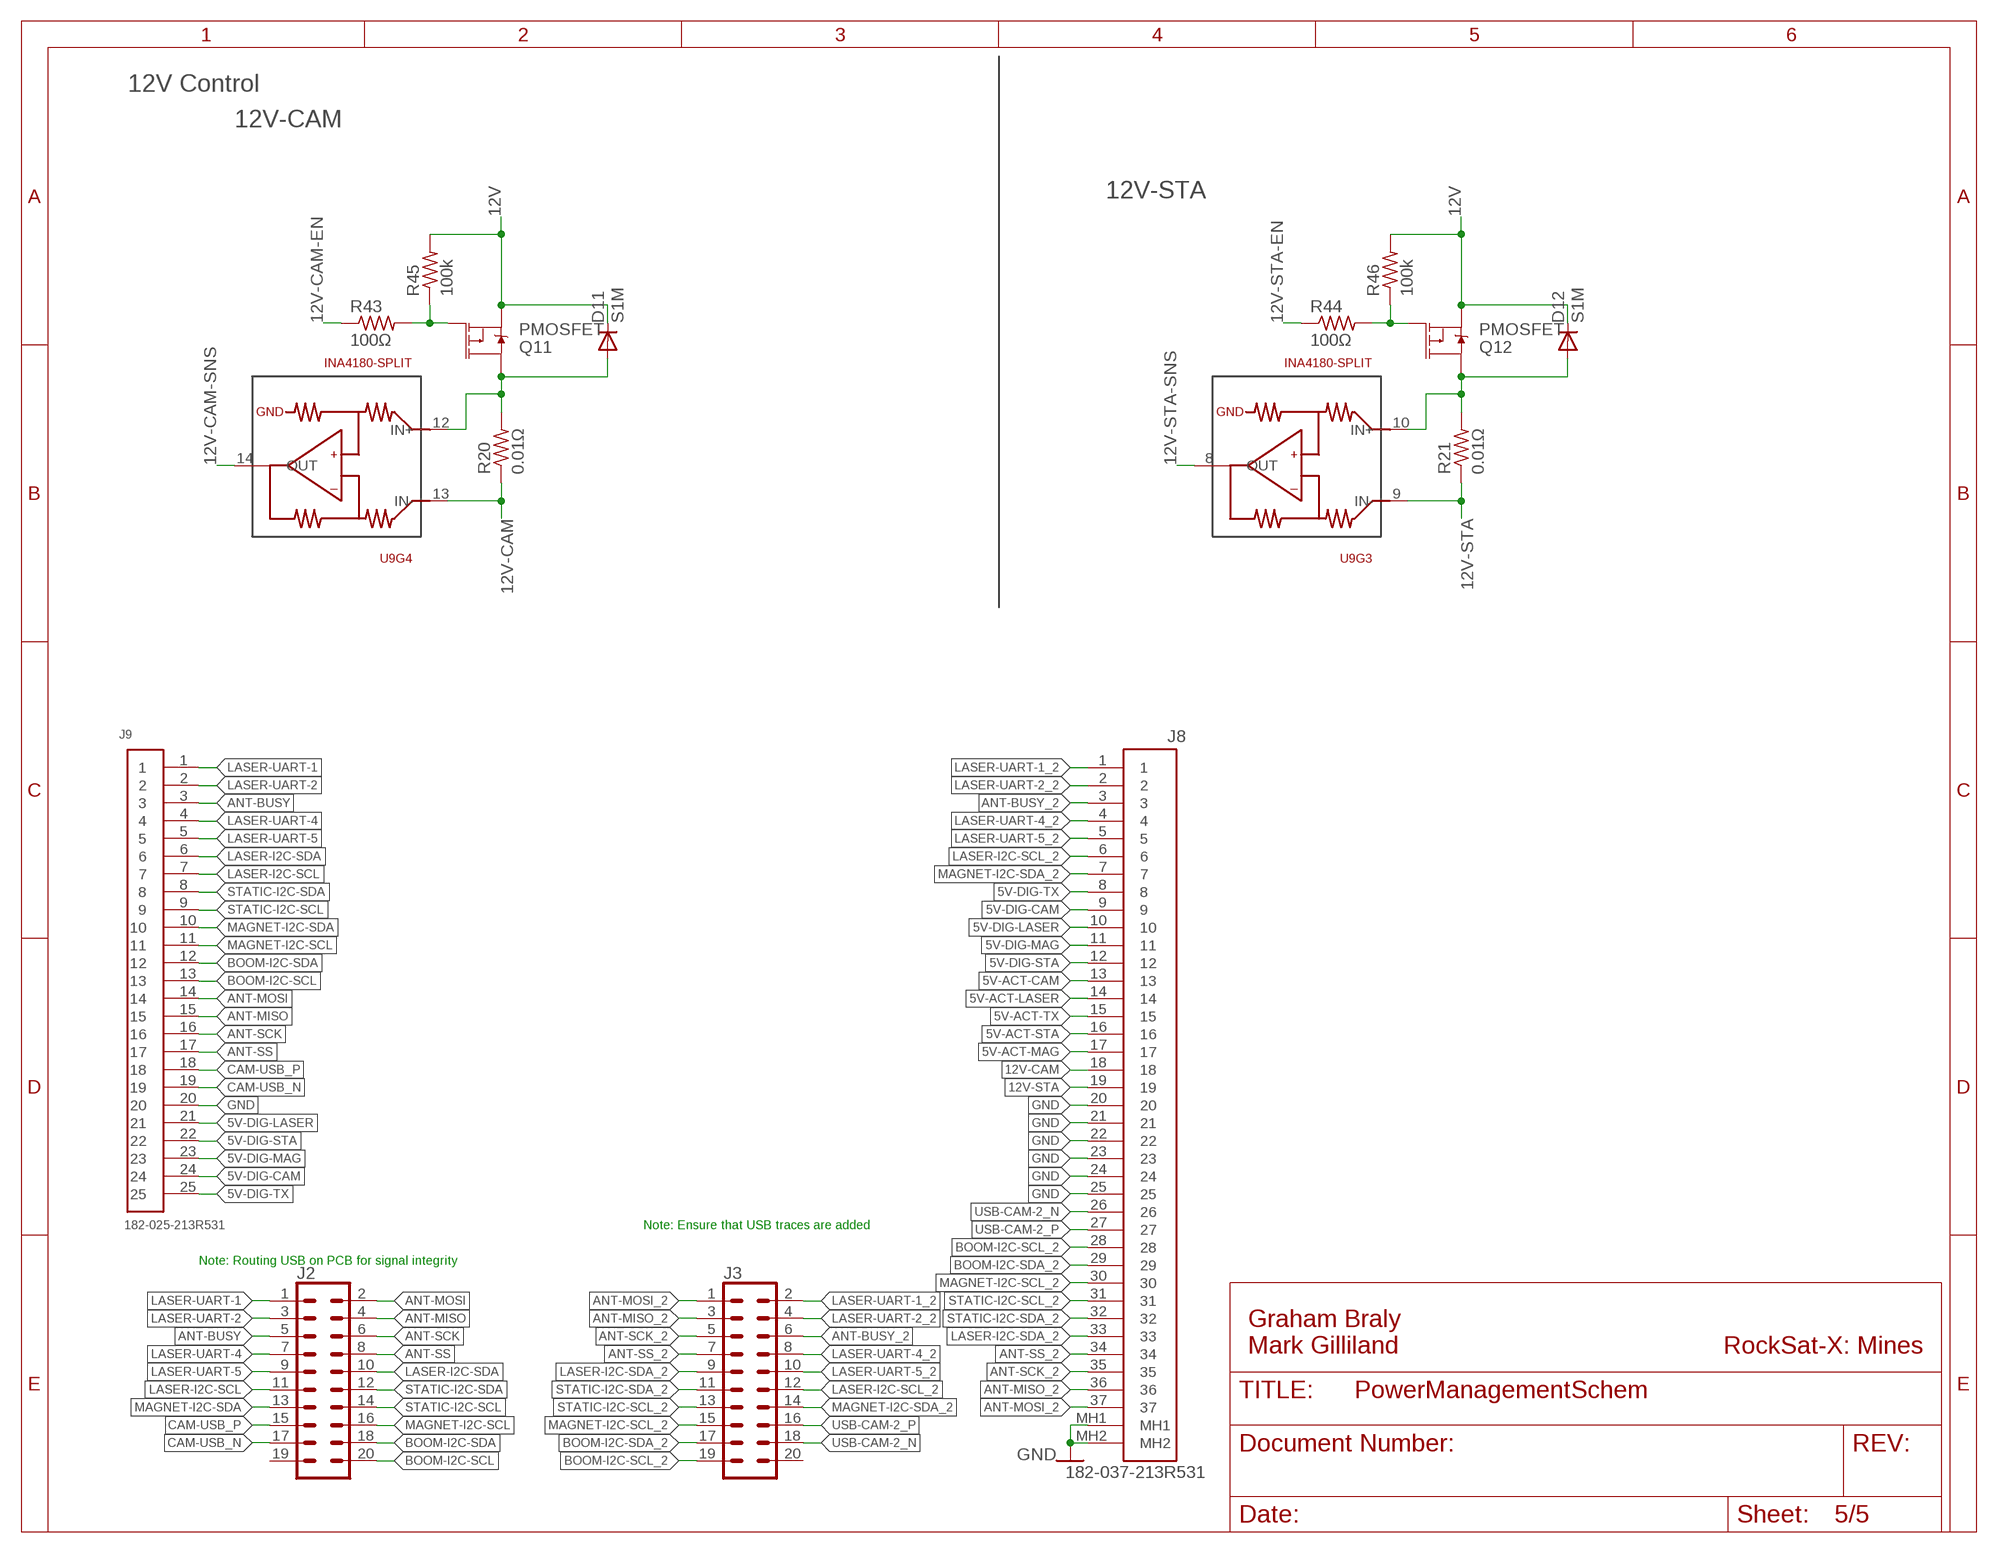
[diagram p4: schematic, sheet 5]

### Parts
D11  S1M  [SMA]
D12  S1M  [SMA]
J2  CONN_10X22X10_LOCK  [2X10_LOCK]
J3  CONN_10X22X10_LOCK  [2X10_LOCK]
J8  182-037-213R531  [182-037-213R531]
J9  182-025-213R531  [182-025-213R531]
Q11  PMOSFET  [DPAK]
Q12  PMOSFET  [DPAK]
R20  0.01Ω  R-US_R1206  [R1206]
R21  0.01Ω  R-US_R1206  [R1206]
R43  100Ω  R-US_R0805  [R0805]
R44  100Ω  R-US_R0805  [R0805]
R45  100k  R-US_R0805  [R0805]
R46  100k  R-US_R0805  [R0805]

### Nets
5V-ACT-CAM: J8.13 ; also sheet 4
5V-ACT-LASER: J8.14 ; also sheet 3
5V-ACT-MAG: J8.17 ; also sheet 4
5V-ACT-STA: J8.16 ; also sheet 4
5V-ACT-TX: J8.15 ; also sheet 3
5V-DIG-CAM: J8.9 J9.24 ; also sheet 4
5V-DIG-LASER: J8.10 J9.21 ; also sheet 3
5V-DIG-MAG: J8.11 J9.23 ; also sheet 4
5V-DIG-STA: J8.12 J9.22 ; also sheet 4
5V-DIG-TX: J8.8 J9.25 ; also sheet 3
12V: D11.C D12.C Q11.3(S) Q12.3(S) R45.2 R46.2 ; also sheet 1
12V-CAM: J8.18 R20.1 U9.13(IN-)
12V-CAM-EN: R43.1 ; also sheet 2
12V-CAM-SNS: U9.14(OUT) ; also sheet 2
12V-STA: J8.19 R21.1 U9.9(IN-)
12V-STA-EN: R44.1 ; also sheet 2
12V-STA-SNS: U9.8(OUT) ; also sheet 2
ANT-BUSY: J2.5 J9.3
ANT-BUSY_2: J3.6 J8.3
ANT-MISO: J2.4 J9.15
ANT-MISO_2: J3.3 J8.36
ANT-MOSI: J2.2 J9.14
ANT-MOSI_2: J3.1 J8.37
ANT-SCK: J2.6 J9.16
ANT-SCK_2: J3.5 J8.35
ANT-SS: J2.8 J9.17
ANT-SS_2: J3.7 J8.34
BOOM-I2C-SCL: J2.20 J9.13
BOOM-I2C-SCL_2: J3.19 J8.28
BOOM-I2C-SDA: J2.18 J9.12
BOOM-I2C-SDA_2: J3.17 J8.29
CAM-USB_N [USB_DIFF_PAIR]: J2.17 J9.19
CAM-USB_P [USB_DIFF_PAIR]: J2.15 J9.18
GND: J8.20 J8.21 J8.22 J8.23 J8.24 J8.25 J8.MH1 J8.MH2 J9.20 ; also sheet 1,2,3,4
LASER-I2C-SCL: J2.11 J9.7
LASER-I2C-SCL_2: J3.12 J8.6
LASER-I2C-SDA: J2.10 J9.6
LASER-I2C-SDA_2: J3.9 J8.33
LASER-UART-1: J2.1 J9.1
LASER-UART-1_2: J3.2 J8.1
LASER-UART-2: J2.3 J9.2
LASER-UART-2_2: J3.4 J8.2
LASER-UART-4: J2.7 J9.4
LASER-UART-4_2: J3.8 J8.4
LASER-UART-5: J2.9 J9.5
LASER-UART-5_2: J3.10 J8.5
MAGNET-I2C-SCL: J2.16 J9.11
MAGNET-I2C-SCL_2: J3.15 J8.30
MAGNET-I2C-SDA: J2.13 J9.10
MAGNET-I2C-SDA_2: J3.14 J8.7
N$34: D11.A Q11.4(D) R20.2 U9.12(IN+)
N$36: D12.A Q12.4(D) R21.2 U9.10(IN+)
N$40: Q11.1(G) R43.2 R45.1
N$43: Q12.1(G) R44.2 R46.1
STATIC-I2C-SCL: J2.14 J9.9
STATIC-I2C-SCL_2: J3.13 J8.31
STATIC-I2C-SDA: J2.12 J9.8
STATIC-I2C-SDA_2: J3.11 J8.32
USB-CAM-2_N [USB_DIFF_PAIR]: J3.18 J8.26
USB-CAM-2_P [USB_DIFF_PAIR]: J3.16 J8.27
Unconnected: J2.19 J3.20

### Notes on the sheet
- 12V Control
- 12V-CAM
- 12V-STA
- Note: Ensure that USB traces are added
- Note: Routing USB on PCB for signal integrity
- Graham Braly
  Mark Gilliland
- RockSat-X: Mines

## Power pins joined to a net without a drawn wire
3V: U8.3V
VBAT: U8.VBAT
VUSB: U8.VUSB

## Library data of the parts
C1-C14 = rcl:C-US: CAPACITOR, American symbol; SPICEPREFIX: C
D1-D12 = diode:S1M
H1-H4 H6 = holes:MOUNT-HOLE: MOUNTING HOLE with drill center marker
J1 = D-Sub Connectors:D15S24A4GV00LF: CONN D-SUB RCPT 15POS VERT SLDR Manufacturer's datasheet <https://www.amphenol-icc.com/media/wysiwyg/files/drawing/c01-8646-0815.pdf>; CREATED_BY: PCBLayout.com; DIGIKEY_PART_NUMBER: 609-1497-ND; MANUFACTURER: Amphenol ICC (FCI); MPN: D15S24A4GV00LF
J2 J3 = SparkFun-Connectors:CONN_10X2: Multi connection point. Often used as Generic Header-pin footprint for 0.1 inch spaced/style header connections On any of the 0.1 inch spaced packages, you can populate with these: Break Away Headers - Straight <https://www.sparkfun.com/products/116> (PRT-00116) Break Away Male Headers - Right Angle <https://www.sparkfun.com/products/553> (PRT-00553) Female Headers <https://www.sparkfun.com/products/115> (PRT-00115) Break Away Headers - Machine Pin <https://www.sparkfun.com/products/117> (PRT-00117) Break Away Female Headers - Swiss Machine Pin <https://www.sparkfun.com/products/743> (PRT-00743) Special note about the "SPECIAL" package: This was SPECIALLY designed to be used with our Graphic LCD Backpack. Be sure you want to use this! It is not only staggered on each line of header holes, but IT IS ALSO offset of the center point of the top and bottom lines by 5 mil. This causes the headers to lock into place on the "standard" footprint on the LCD screen. The extra squares on the tdocu layer are there simply to reference other pins (if you were to actually populate a longer header than ten long - this is what we do with the backpacks).
J8 = D-Sub Connectors:182-037-213R531: CONN D-SUB RCPT 37POS R/A SOLDER Manufacturer's datasheet <https://media.digikey.com/pdf/Data%20Sheets/Norcomp%20PDFs/182-YYY-213RYY1.pdf>; CREATED_BY: PCBLayout.com; DIGI_KEY_PART_NUMBER: 182-37FE-ND; MANUFACTURER: NorComp Inc.; MPN: 182-037-213R531
J9 = D-Sub Connectors:182-025-213R531: CONN D-SUB RCPT 25POS R/A SOLDER Manufacturer's datasheet <https://media.digikey.com/pdf/Data%20Sheets/Norcomp%20PDFs/182-YYY-213RYY1.pdf>; CREATED_BY: PCBLayout.com; DIGIKEY_PART_NO: 182-25FE-ND; MANUFACTURER: NorComp Inc.; MPN: 182-025-213R531
JP1 JP2 = SparkFun-Jumpers:JUMPER-SMT_2_NO: Normally open jumper This jumper has two pads in close proximity to each other. Apply solder to close the connection. Round pads are easier to solder for beginners, but are a lot larger. SparkFun Product that uses the round pads: SparkFun EL Sequencer <https://www.sparkfun.com/products/12781>
Q1-Q12 = usbMotorDriverParts:PMOSFET
R1-R46 = rcl:R-US_: RESISTOR, American symbol; SPICEPREFIX: R
TP1-TP16 TP-AUX-MUX TP_5V-ACT_CTRL TP_5V-DIG_CTRL TP_12V_CTRL = testpad:TP: Test pad
U1 = CUI_DCDC_Conv:VX7805-500; MANUFACTURER: CUI Inc; PARTREV: 1.0; STANDARD: Manufacturer recommendations
U2 = CUI_DCDC_Conv:PYB20-Q24-S5: 12/-12 Vdc, 0.83 A, 20 W, 9~36 Vdc Input Range; MANUFACTURER: CUI Inc; PARTREV: 1.04; STANDARD: Manufacturer Recommendations
U3 = CUI_DCDC_Conv:PYB30-Q48-S5: 12/-12 Vdc, 1.25 A, 30 W, 9~36 Vdc Input Range; MANUFACTURER: CUI Inc; PARTREV: 1.02; STANDARD: Manufacturer Recommendations
U4 = CUI_DCDC_Conv:PYB30-Q48-S12: 12/-12 Vdc, 1.25 A, 30 W, 9~36 Vdc Input Range; MANUFACTURER: CUI Inc; PARTREV: 1.02; STANDARD: Manufacturer Recommendations
U5 = PowerManagementParts:3V3REG: Diodes Inc. 800mA 3.3V cheap VREG AZ1117CH-3.3TRG1 AZ1117CH-3.3TRG1DICT-ND
U6 U7 U9 = PowerManagementParts:INA4180-SPLIT: INA 4180 Current Sense amplifier (TSSOP14 package) https://www.digikey.com/product-detail/en/texas-instruments/INA4180A2IPWR/296-49095-1-ND/9091907
U8 = PowerManagementParts:TEENSY-4.0: Teensy 4.0 Footprint Mechanical footprint with connectors for Teensy Development Board with ARM Cortex. SparkFun Products: Teensy 4.0 <https://www.sparkfun.com/products/15583>; SF_ID: DEV-12646
U10-U12 = SparkFun-Sensors:TMP36: TMP36 Precision Analog °C Temperature Sensor The TMP36 is a low voltage, precision centigrade temperature sensor. It provides a voltage output that is linearly proportional to the Celsius temperature. It also doesn’t require any external calibration to provide typical accuracies of ±1°C at +25°C and ±2°C over the −40°C to +125°C temperature range. We like it because it’s so easy to use: Just give the device a ground and 2.7 to 5.5 VDC and read the voltage on the Vout pin. The output voltage can be converted to temperature easily using the scale factor of 10 mV/°C. Datasheet <http://cdn.sparkfun.com/datasheets/Sensors/Temp/TMP35_36_37.pdf> SparkFun Products Temperature Sensor - TMP36 <https://www.sparkfun.com/products/10988> (SEN-10988) SparkFun Danger Shield <https://www.sparkfun.com/products/11649> (DEV-11649); PROD_ID: IC-09880; SF_ID: SEN-10988
U$9 U$10 U$17 U$20 = PowerManagementParts:FLAT_LED
U$18 U$19 = PowerManagementParts:CD4051B_ALT: CD4051BM 8-1 Mux/Demux in SOIC16 Package.

## Net classes
1 USB_DIFF_PAIR: width 0.203 mm, clearance 0.203 mm to class 0, clearance 0.203 mm
2 hv-lines: clearance 0.254 mm to class 0, clearance 0.254 mm to class 1, clearance 0.254 mm